# Altium schematic sheet Hambmark_PCB-practice-STM32-two-wheel-balancing-car__PRJ__2_BalanceControl.SchDoc
size A3; SheetNumber: 1; SheetTotal: 2
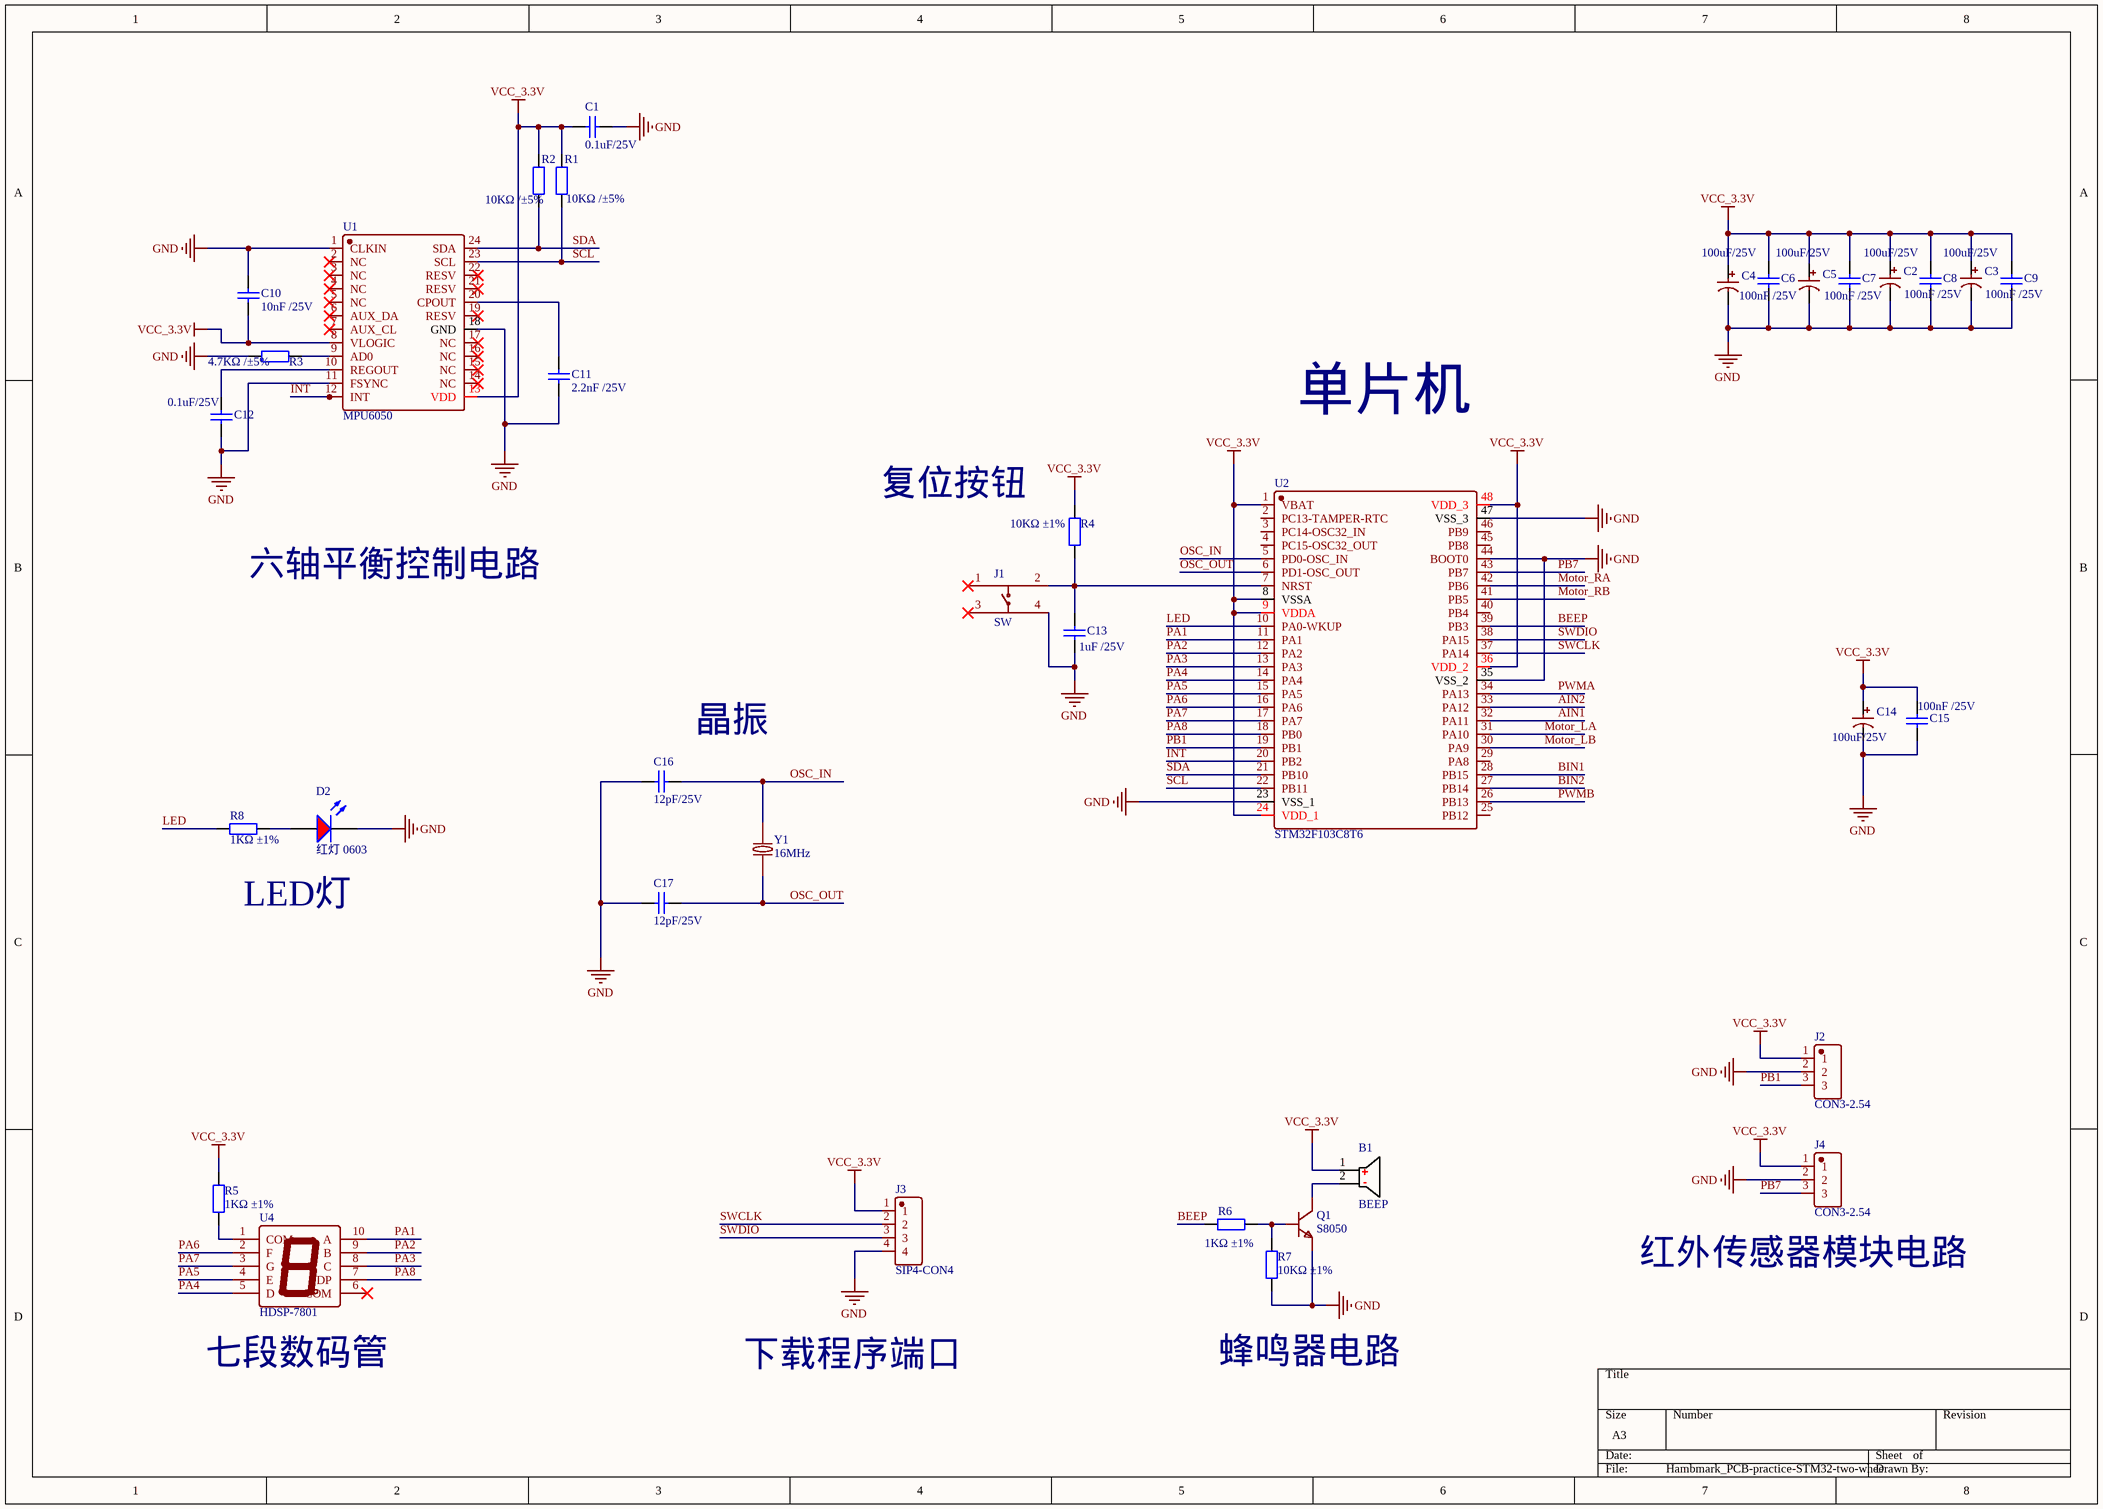
[diagram p0: Hambmark_PCB-practice-STM32-two-wheel-balancing-car__PRJ__2_BalanceControl.SchDoc]

## Parts
B1  BEEP  [BEEP-9MM]
C1  0.1uF/25V  [C0603]
C2  100uF/25V  [C0603]
C3  100uF/25V  [C0603]
C4  100uF/25V  [C0603]
C5  100uF/25V  [C0603]
C6  100nF /25V  [C0603]
C7  100nF /25V  [C0603]
C8  100nF /25V  [C0603]
C9  100nF /25V  [C0603]
C10  10nF /25V  [C0603]
C11  2.2nF /25V  [C0603]
C12  0.1uF/25V  [C0603]
C13  1uF /25V  [C0603]
C14  100uF/25V  [C0603]
C15  100nF /25V  [C0603]
C16  12pF/25V  [C0603]
C17  12pF/25V  [C0603]
D2  红灯 0603  [LED-0603_S1]
J1  SW  [SW-SMD_4P-L6.0-W6.0]
J2  CON3-2.54  [DIP-3P-2.54-W]
J3  SIP4-CON4  [DIP-4P-2.54-N]
J4  CON3-2.54  [DIP-3P-2.54-W]
Q1  S8050  [SOT-23-3]
R1  10KΩ /±5%  [R0603]
R2  10KΩ /±5%  [R0603]
R3  4.7KΩ /±5%  [R0603]
R4  10KΩ ±1%  [R0603]
R5  1KΩ ±1%  [R0603]
R6  1KΩ ±1%  [R0603]
R7  10KΩ ±1%  [R0603]
R8  1KΩ ±1%  [R0603]
U1  MPU6050  [QFN-24_L4.0-W4.0-P0.50-BL]
U2  STM32F103C8T6  [LQFP-48_L7.0-W7.0]
U4  HDSP-7801  [LED-SEG-SMD_HDSP-7801]
Y1  16MHz  [CRYSTAL-SMD_L3.2-W1.5]

## Nets
GND: C1.2 C2.2 C3.2 C4.2 C5.2 C6.1 C7.1 C8.1 C9.1 C10.2 C11.1 C12.1 C13.2 C14.2 C15.1 C16.2 C17.2 D2.K J1.4 J2.2 J3.4 J4.2 Q1.2(E) R3.2 R7.1 U1.1(CLKIN) U1.11(FSYNC) U1.18(GND) U2.23(VSS_1) U2.35(VSS_2) U2.44(BOOT0) U2.47(VSS_3)
VCC_3.3V: B1.1 C1.1 C2.1 C3.1 C4.1 C5.1 C6.2 C7.2 C8.2 C9.2 C10.1 C14.1 C15.2 J2.1 J3.1 J4.1 R1.2 R2.2 R4.2 R5.1 U1.8(VLOGIC) U1.13(VDD) U2.1(VBAT) U2.8(VSSA) U2.9(VDDA) U2.24(VDD_1) U2.36(VDD_2) U2.48(VDD_3)
AIN1: U2.32(PA11)
AIN2: U2.33(PA12)
BEEP: R6.1 U2.39(PB3)
BIN1: U2.28(PB15)
BIN2: U2.27(PB14)
INT: U1.12(INT) U2.20(PB2)
LED: R8.2 U2.10(PA0-WKUP)
Motor_LA: U2.31(PA10)
Motor_LB: U2.30(PA9)
Motor_RA: U2.42(PB6)
Motor_RB: U2.41(PB5)
OSC_IN: C16.1 U2.5(PD0-OSC_IN) Y1.2
OSC_OUT: C17.1 U2.6(PD1-OSC_OUT) Y1.1
PA1: U2.11(PA1) U4.10(A)
PA2: U2.12(PA2) U4.9(B)
PA3: U2.13(PA3) U4.8(C)
PA4: U2.14(PA4) U4.5(D)
PA5: U2.15(PA5) U4.4(E)
PA6: U2.16(PA6) U4.2(F)
PA7: U2.17(PA7) U4.3(G)
PA8: U2.18(PB0) U4.7(DP)
PB1: J2.3 U2.19(PB1)
PB7: J4.3 U2.43(PB7)
PWMA: U2.34(PA13)
PWMB: U2.26(PB13)
SCL: R1.1 U1.23(SCL) U2.22(PB11)
SDA: R2.1 U1.24(SDA) U2.21(PB10)
SWCLK: J3.2 U2.37(PA14)
SWDIO: J3.3 U2.38(PA15)
NetB1_2: B1.2 Q1.3(C)
NetC11_2: C11.2 U1.20(CPOUT)
NetC12_2: C12.2 U1.10(REGOUT)
NetC13_1: C13.1 J1.2 R4.1 U2.7(NRST)
NetD2_A: D2.A R8.1
NetQ1_1: Q1.1(B) R6.2 R7.2
NetR3_1: R3.1 U1.9(AD0)
NetR5_2: R5.2 U4.1(COM)

Not connected (* = marked no-connect by the designer): J1 1* 3*; U1 2(NC)* 3(NC)* 4(NC)* 5(NC)* 6(AUX_DA)* 7(AUX_CL)* 14(NC)* 15(NC)* 16(NC)* 17(NC)* 19(RESV)* 21(RESV)* 22(RESV)*; U2 2(PC13-TAMPER-RTC) 3(PC14-OSC32_IN) 4(PC15-OSC32_OUT) 25(PB12) 29(PA8) 40(PB4) 45(PB8) 46(PB9); U4 6(COM)*

## Notes on the sheet
- 单片机
- 复位按钮
- 六轴平衡控制电路
- (near C16) 晶振
- LED灯
- (near J4) 红外传感器模块电路
- (near U4) 七段数码管
- 下载程序端口
- 蜂鸣器电路

## Library data of the parts
C1 C10-C12 C15 = 1206 100nF (104) 10% 50V: 贴片电容; ComponentLink1Description: 供应商链接; ComponentLink1URL: http://www.szlcsc.com/product/details_25237.html; Package: 1206; Supplier: LC; SuppliersPartNumber: C24497
C6-C9 C13 = 0402 20pF (200) 5% 50V: 贴片电容; ComponentLink1Description: 供应商链接; ComponentLink1URL: http://www.szlcsc.com/product/details_1906.html; Package: 0402; Supplier: LC; SuppliersPartNumber: C1554
C16 C17 = 0805 100nF(104) 10% 50V: 贴片电容; ComponentLink1Description: 供应商链接; ComponentLink1URL: http://www.szlcsc.com/product/details_50686.html; Package: 0805; Supplier: LC; SuppliersPartNumber: C49678
D2 = 0603 红灯: 发光二极管; ComponentLink1Description: 供应商链接; ComponentLink1URL: http://www.szlcsc.com/product/details_2659.html; Package: 0603; Supplier: LC; SuppliersPartNumber: C2286
R1-R4 = 0402 0Ω (0R0) 1%: 贴片电阻; ComponentLink1Description: 供应商链接; ComponentLink1URL: http://www.szlcsc.com/product/details_17853.html; Package: 0402; Supplier: LC; SuppliersPartNumber: C17168
R5-R8 = 0603 1KΩ (1001) 1%: 贴片电阻; ComponentLink1Description: 供应商链接; ComponentLink1URL: http://www.szlcsc.com/product/details_21904.html; Package: 0603; Supplier: LC; SuppliersPartNumber: C21190
Y1 = FC-135R 32.7680KF